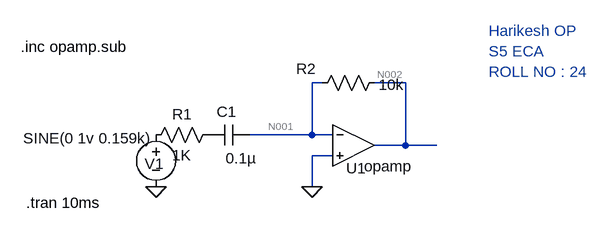
[diagram p0: schematic DIFFERENTIATOR.asc]
DIFFERENTIATOR.asc, the LTspice schematic file:
Version 4
SHEET 1 880 680
WIRE 160 112 144 112
WIRE 288 112 240 112
WIRE 144 192 144 112
WIRE 144 192 48 192
WIRE 176 192 144 192
WIRE 288 208 288 112
WIRE 288 208 240 208
WIRE 336 208 288 208
WIRE 176 224 144 224
WIRE 144 272 144 224
FLAG 144 272 0
FLAG -96 272 0
SYMBOL OpAmps\\opamp 208 144 R0
WINDOW 0 -11 99 Left 2
SYMATTR InstName U1
SYMBOL voltage -96 176 R0
WINDOW 123 0 0 Left 0
WINDOW 39 0 0 Left 0
WINDOW 0 -17 60 Left 2
WINDOW 3 -204 21 Left 2
SYMATTR InstName V1
SYMATTR Value SINE(0 1v 0.159k)
SYMBOL res 0 176 R90
WINDOW 0 0 56 VBottom 2
WINDOW 3 32 56 VTop 2
SYMATTR InstName R1
SYMATTR Value 1K
SYMBOL cap 48 176 R90
WINDOW 0 -4 35 VBottom 2
WINDOW 3 36 13 VTop 2
SYMATTR InstName C1
SYMATTR Value 0.1µ
SYMBOL res 256 96 R90
WINDOW 0 10 121 VBottom 2
WINDOW 3 3 -10 VTop 2
SYMATTR InstName R2
SYMATTR Value 10k
TEXT -304 56 Left 2 !.inc opamp.sub
TEXT 416 32 Left 2 ;Harikesh OP\nS5 ECA \nROLL NO : 24
TEXT -296 296 Left 2 !.tran 10ms

The netlist it stands for:
* DIFFERENTIATOR.asc
XU1 N001 0 N002 opamp Aol=100K GBW=10Meg  ; pins invin noninvin out
V1 P001 0 SINE(0 1v 0.159k)
R1 P002 P001 1K
C1 N001 P002 0.1µ
R2 N002 N001 10k
.inc opamp.sub
* Harikesh OP
* S5 ECA
* ROLL NO : 24
.tran 10ms
.backanno
.end

* Results of the author's LTspice run, read from the files saved beside the schematic
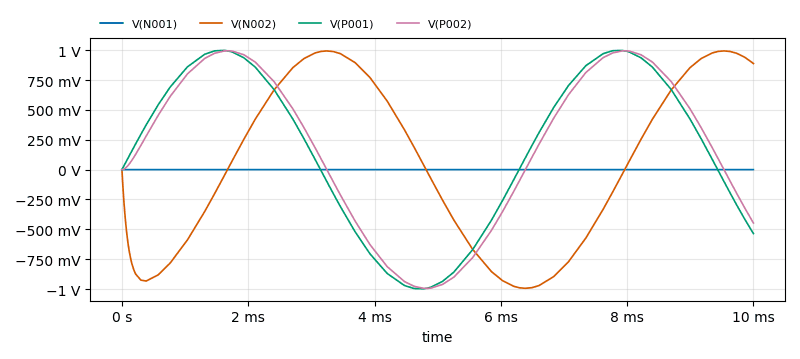
[diagram p1: Transient Analysis of DIFFERENTIATOR.asc, plotted from the saved traces]
* Transient Analysis, 1 run:
*   V(N001): min -18.53 µV, max 156.6 µV, average -1.826 µV, rms 17.52 µV, last -1.781 µV
*   V(N002): min -994.1 mV, max 994.1 mV, average 44.7 mV, rms 710.2 mV, last 888.1 mV
*   V(P001): min -998.2 mV, max 998.7 mV, average 183.8 mV, rms 690.6 mV, last -535.8 mV
*   V(P002): min -994.8 mV, max 994.9 mV, average 188.3 mV, rms 685.5 mV, last -447 mV